# Altium project Hidro-Extra.PrjPCB
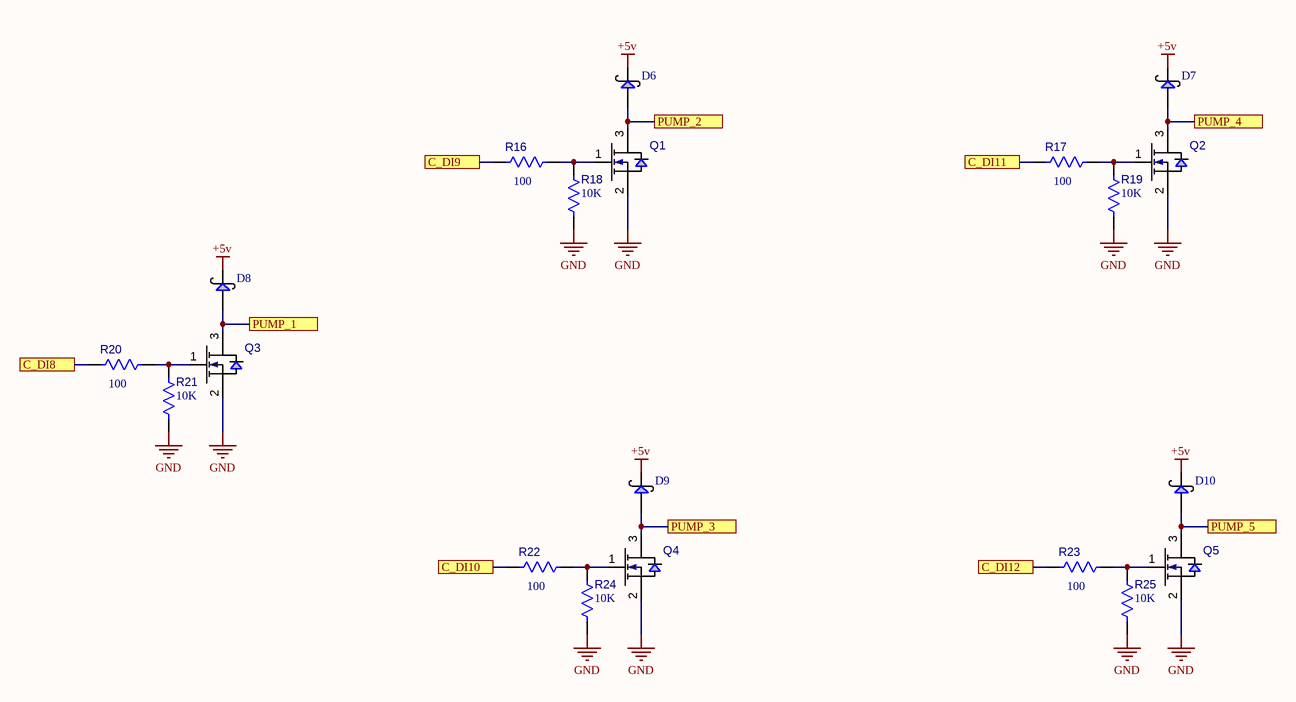
[diagram p0: pump.SchDoc]
3 sheets, 85 parts. Net scope: flat (ports and power ports of the same name join across sheets).
Board file: PCB_HidroExtra_v1.0.PcbDoc
Sheets:
  pump.SchDoc
  adc.SchDoc
  connectors.SchDoc

## Sheet pump.SchDoc
size A4

### Parts
D6  (no value)  [SOD123]
D7  (no value)  [SOD123]
D8  (no value)  [SOD123]
D9  (no value)  [SOD123]
D10  (no value)  [SOD123]
Q1  BSS138  [SOT23_N_123]  (value not drawn)
Q2  BSS138  [SOT23_N_123]  (value not drawn)
Q3  BSS138  [SOT23_N_123]  (value not drawn)
Q4  BSS138  [SOT23_N_123]  (value not drawn)
Q5  BSS138  [SOT23_N_123]  (value not drawn)
R16  100  [0805]
R17  100  [0805]
R18  10K  [0805]
R19  10K  [0805]
R20  100  [0805]
R21  10K  [0805]
R22  100  [0805]
R23  100  [0805]
R24  10K  [0805]
R25  10K  [0805]

### Ports
C_DI8, C_DI9, C_DI10, C_DI11, C_DI12, PUMP_1, PUMP_2, PUMP_3, PUMP_4, PUMP_5

### Nets
+5v: D6.2 D7.2 D8.2 D9.2 D10.2
GND: Q1.2 Q2.2 Q3.2 Q4.2 Q5.2 R18.1 R19.1 R21.1 R24.1 R25.1
NetD6_1: D6.1 Q1.3 ; port PUMP_2
NetD7_1: D7.1 Q2.3 ; port PUMP_4
NetD8_1: D8.1 Q3.3 ; port PUMP_1
NetD9_1: D9.1 Q4.3 ; port PUMP_3
NetD10_1: D10.1 Q5.3 ; port PUMP_5
NetJ6_1: R23.1 ; port C_DI12
NetJ6_2: R17.1 ; port C_DI11
NetJ6_3: R22.1 ; port C_DI10
NetJ6_4: R16.1 ; port C_DI9
NetJ6_5: R20.1 ; port C_DI8
NetQ1_1: Q1.1 R16.2 R18.2
NetQ2_1: Q2.1 R17.2 R19.2
NetQ3_1: Q3.1 R20.2 R21.2
NetQ4_1: Q4.1 R22.2 R24.2
NetQ5_1: Q5.1 R23.2 R25.2

### Library data of the parts
D6-D10 = MBRX160: SOD123
Q1-Q5 = BSS138: N-Channel MOSFET; Manufacturer: Fairchild; Voltage-Rated: 50V; Value: 6 Ohm Rdson; Package: SOT23
R16-R25 = Res: Resistor; Tolerance: 1%; Package: 0603
  R16 R17 R20 R22 R23: Value: 100
  R18 R19 R21 R24 R25: Value: 10K

## Sheet adc.SchDoc
size A4
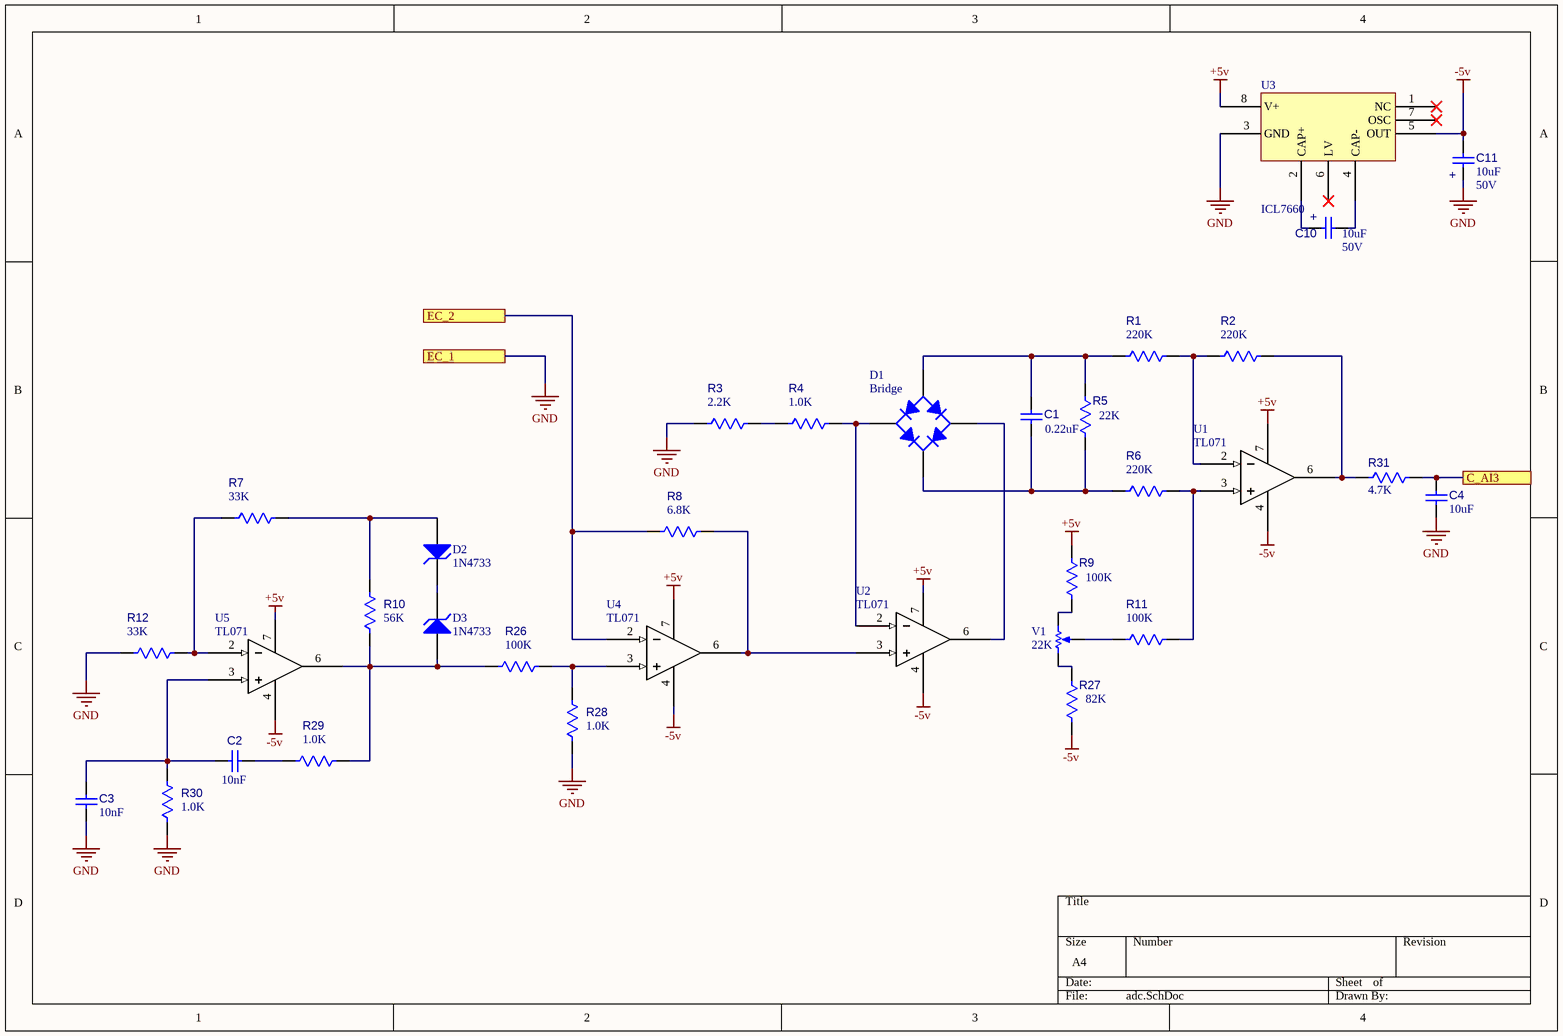
[diagram p1: adc.SchDoc]

### Parts
(Parts that share a designator on the sheet are numbered #1, #2 ... from top to bottom, then left to right.)
C1  0.22uF  [RAD-0.1]
C2  10nF  [0805]
C3  value 10nF  [0805]  (hidden comment: Cap)
C4  value 10uF  [CAPC1608x85N]  (hidden comment: Cap)
C10  Voltage-Rated: 50V  [CAPC3216x130N]  (hidden comment: 10uF)
C11  Voltage-Rated: 50V  [CAPC3216x130N]  (hidden comment: 10uF)
D1  Bridge  [BRIDGE_W]
D2  1N4733  [DO-35A]
D3  1N4733  [DO-35A]
R1  220K  [AXIAL-0.3]
R2  220K  [AXIAL-0.3]
R3  2.2K  [0805]
R4  1.0K  [0805]
R5  22K  [0805]
R6  220K  [AXIAL-0.3]
R7  33K  [0805]
R8  6.8K  [AXIAL-0.3]
R9  100K  [0805]
R10  56K  [0603]
R11  100K  [0805]
R12  33K  [0805]
R26#1  100K  [0805]
R27#1  82K  [0603]
R28#1  1.0K  [0805]
R29#1  1.0K  [0805]
R30  1.0K  [0805]
R31  4.7K  [0805]
U1  TL071  [DIP-8]
U2  TL071  [DIP-8]
U3  ICL7660  [SO8_N]
U4  TL071  [DIP-8]
U5  TL071  [DIP-8]
V1  22K  [TB-3x200]

### Ports
C_AI3, EC_1, EC_2

### Nets
+5v: R9.2 U1.7(+Vcc) U2.7(+Vcc) U3.8(V+) U4.7(+Vcc) U5.7(+Vcc)
-5v: C11.2 R27#1.1 U1.4(-Vcc) U2.4(-Vcc) U3.5(OUT) U4.4(-Vcc) U5.4(-Vcc)
GND: C3.2 C4.2 C11.1 R3.1 R12.1 R28#1.2 R30.2 U3.3(GND) ; port EC_1
NetC1_1: C1.1 D1.3(A) R1.1 R5.2
NetC1_2: C1.2 D1.1(K) R5.1 R6.1
NetC2_1: C2.1 C3.1 R30.1 U5.3(+)
NetC2_2: C2.2 R29#1.1
NetC4_1: C4.1 R31.1 ; port C_AI3
NetC10_1: C10.1 U3.2(CAP+)
NetC10_2: C10.2 U3.4(CAP-)
NetD1_2: D1.2(C) R4.2 U2.2(-)
NetD1_4: D1.4(C) U2.6(output)
NetD2_1: D2.1(A) R7.2 R10.1
NetD2_2: D2.2(K) D3.2(K)
NetD3_1: D3.1(A) R10.2 R26#1.1 R29#1.2 U5.6(output)
NetJ17_2: R8.1 U4.2(-) ; port EC_2
NetR1_2: R1.2 R2.1 U1.2(-)
NetR2_2: R2.2 R31.2 U1.6(output)
NetR3_2: R3.2 R4.1
NetR6_2: R6.2 R11.2 U1.3(+)
NetR7_1: R7.1 R12.2 U5.2(-)
NetR8_2: R8.2 U2.3(+) U4.6(output)
NetR9_1: R9.1 V1.3(BOT)
NetR11_1: R11.1 V1.2(TAP)
NetR26#1_2: R26#1.2 R28#1.1 U4.3(+)
NetR27#1_2: R27#1.2 V1.1(TOP)

Not connected (* = marked no-connect by the designer): U3 1(NC)* 6(LV)* 7(OSC)*

### Notes on the sheet
- (in symbol Cap Pol) +

### Library data of the parts
C1-C4 = Cap: Tolerance: ±10%; Voltage-Rated: 50V
  C1: Package: 0603; Value: 0.22uF
  C2: Package: 0805; Value: 10nF
  C3: Package: 0805
  C4: Package: 0603
C10 C11 = Cap Pol: Cap; Manufacturer: Panasonic; MfgPartNum: EEE-FC1H220P; Tolerance: ±10%; 3rdMfgr: Vishay / MAL214097103E3; Current: 90 mARMS; Package: 8mm dia.; Value: 10uF
D1 = Bridge: Full Wave Diode Bridge; Published: 8-Jun-2000; LatestRevisionDate: 29-May-2009; LatestRevisionNote: Sch pins A & K swapped.; DatasheetVersion: E2732B; PackageReference: D-38; Publisher: Altium Limited; PackageDescription: Bridge Rectifier; 4 Terminals; Body 9.4 x 9.4 mm (typ); Pitch 5.08 mm
D2 D3 = D Zener: Zener Diode 3.3v; Published: 8-Jun-2000; LatestRevisionDate: 17-Jul-2002; LatestRevisionNote: Re-released for DXP Platform.; PackageReference: DIODE-0.7; Publisher: Altium Limited; PackageDescription: Diode, Thru-Hole; 2 Leads; 0.7 in Pin Spacing
R1-R12 R26#1 R27#1 R28#1 R29#1 R30 R31 = Res: Resistor; Tolerance: 1%; Package: 0603
  R1 R2 R6: Value: 220K
  R3: Value: 2.2K
  R4 R28#1 R29#1 R30: Value: 1.0K
  R5: Value: 22K
  R7 R12: Value: 33K
  R8: Value: 6.8K
  R9 R11 R26#1: Value: 100K
  R10: Value: 56K
  R27#1: Value: 82K
  R31: Value: 4.7K
U1 U2 U4 U5 = TL071: Low-noise jfet-input operational amplifiers
U3 = ICL7660: CMOS Voltage Converters, from positive to negative for an input range of +1.5V to +10.0V
V1 = Preset: Potentiometer; Sim Note: Enter the Resistance value and the set point into parameter fields.; Set Position: 0.5; Published: 8-Jun-2000; LatestRevisionDate: 17-Jul-2002; LatestRevisionNote: Re-released for DXP Platform.; PackageReference: VR5; Publisher: Altium Limited; PackageDescription: Variable Resistor, Thru-Hole; 3 Leads; Value: 22K

## Sheet connectors.SchDoc
size A4
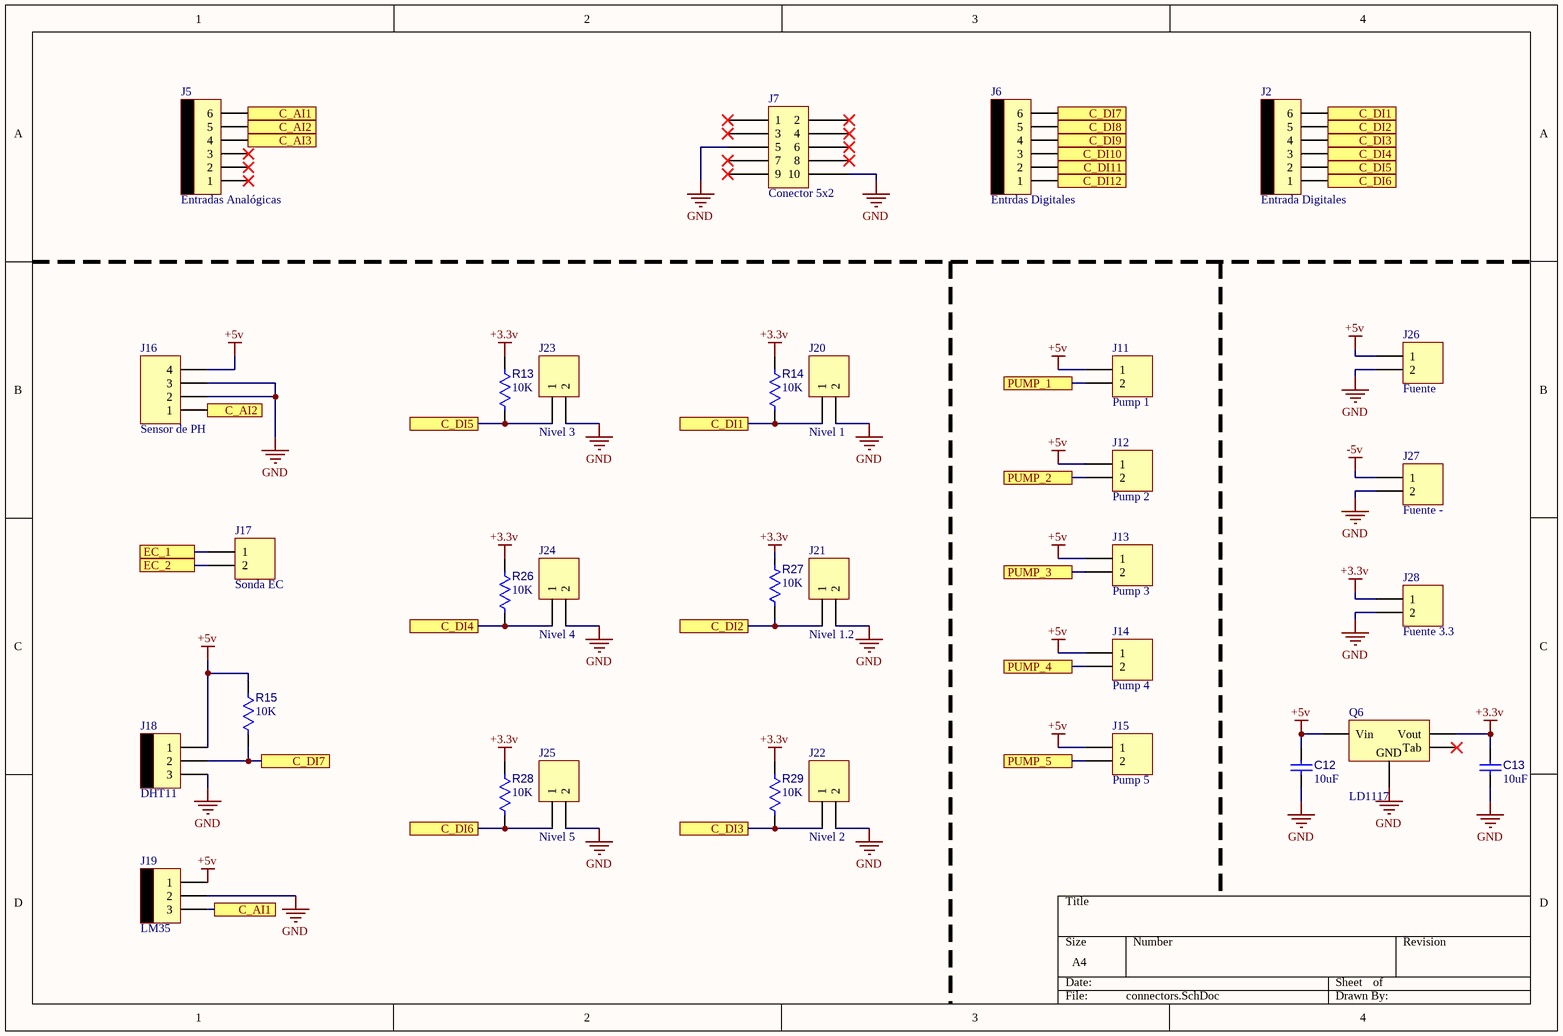
[diagram p2: connectors.SchDoc]

### Parts
(Parts that share a designator on the sheet are numbered #1, #2 ... from top to bottom, then left to right.)
C12  10uF  [CAPC3216x130N]
C13  10uF  [CAPC3216x130N]
J2  Entrada Digitales  [MOLEX6]
J5  Entradas Analógicas  [MOLEX6]
J6  Entrdas Digitales  [MOLEX6]
J7  Conector 5x2  [CONN_5x2_BOX]
J11  Pump 1  [MOLEX2]
J12  Pump 2  [MOLEX2]
J13  Pump 3  [MOLEX2]
J14  Pump 4  [MOLEX2]
J15  Pump 5  [MOLEX2]
J16  Sensor de PH  [HDR1X4]
J17  Sonda EC  [HDR1X2H]
J18  DHT11  [MOLEX3]
J19  LM35  [MOLEX3]
J20  Nivel 1  [MOLEX2]
J21  Nivel 1.2  [MOLEX2]
J22  Nivel 2  [MOLEX2]
J23  Nivel 3  [MOLEX2]
J24  Nivel 4  [MOLEX2]
J25  Nivel 5  [MOLEX2]
J26  Fuente  [CON_2_156]
J27  Fuente -  [HDR1X2]
J28  Fuente 3.3  [HDR1X2]
Q6  LD1117  [SOT223_N]
R13  10K  [0805]
R14  10K  [0805]
R15  10K  [0805]
R26#2  10K  [0805]
R27#2  10K  [0805]
R28#2  10K  [0805]
R29#2  10K  [0805]

### Ports
C_AI1, C_AI2, C_AI3, C_DI1, C_DI2, C_DI3, C_DI4, C_DI5, C_DI6, C_DI7, C_DI8, C_DI9, C_DI10, C_DI11, C_DI12, EC_1, EC_2, PUMP_1, PUMP_2, PUMP_3, PUMP_4, PUMP_5

### Nets
+3.3v: C13.2 J28.1 Q6.2(Vout) R13.2 R14.2 R26#2.2 R27#2.2 R28#2.2 R29#2.2
+5v: C12.1 J11.1 J12.1 J13.1 J14.1 J15.1 J16.4 J18.1 J19.1 J26.1 Q6.3(Vin) R15.2
-5v: J27.1
GND: C12.2 C13.1 J7.5 J7.10 J16.2 J16.3 J17.1 J18.3 J19.2 J20.2 J21.2 J22.2 J23.2 J24.2 J25.2 J26.2 J27.2 J28.2 Q6.1(GND) ; port EC_1
NetC4_1: J5.4 ; port C_AI3
NetD6_1: J12.2 ; port PUMP_2
NetD7_1: J14.2 ; port PUMP_4
NetD8_1: J11.2 ; port PUMP_1
NetD9_1: J13.2 ; port PUMP_3
NetD10_1: J15.2 ; port PUMP_5
NetJ2_1: J2.1 J25.1 R28#2.1 ; port C_DI6
NetJ2_2: J2.2 J23.1 R13.1 ; port C_DI5
NetJ2_3: J2.3 J24.1 R26#2.1 ; port C_DI4
NetJ2_4: J2.4 J22.1 R29#2.1 ; port C_DI3
NetJ2_5: J2.5 J21.1 R27#2.1 ; port C_DI2
NetJ2_6: J2.6 J20.1 R14.1 ; port C_DI1
NetJ5_5: J5.5 J16.1 ; port C_AI2
NetJ5_6: J5.6 J19.3 ; port C_AI1
NetJ6_1: J6.1 ; port C_DI12
NetJ6_2: J6.2 ; port C_DI11
NetJ6_3: J6.3 ; port C_DI10
NetJ6_4: J6.4 ; port C_DI9
NetJ6_5: J6.5 ; port C_DI8
NetJ6_6: J6.6 J18.2 R15.1 ; port C_DI7
NetJ17_2: J17.2 ; port EC_2

Not connected (* = marked no-connect by the designer): J5 1* 2* 3*; J7 1* 2* 3* 4* 6* 7* 8* 9*; Q6 4(Tab)*

### Library data of the parts
C12 C13 = Cap: Tolerance: ±10%; Voltage-Rated: 6.3V; Package: 0603; Value: 10uF
J2 J5 J6 = MOLEX6
J11-J15 J20-J26 = Header 2: Header, 2-Pin; LatestRevisionDate: 17-Jul-2002; LatestRevisionNote: Re-released for DXP Platform.; Publisher: Altium Limited
J16 = Header 4: LatestRevisionDate: 17-Jul-2002; LatestRevisionNote: Re-released for DXP Platform.; Publisher: Altium Limited
J17 = Header 2H: Header, 2-Pin, Right Angle; LatestRevisionDate: 17-Jul-2002; LatestRevisionNote: Re-released for DXP Platform.; Publisher: Altium Limited
J18 J19 = MOLEX3
J27 J28 = Header 2: LatestRevisionDate: 17-Jul-2002; LatestRevisionNote: Re-released for DXP Platform.; Publisher: Altium Limited
Q6 = LD1117: Voltage Reg., Low Drop; PackageReference: SOT-223; PackageDescription: 3-Pin Transistor Outline Package 2.54 mm Pitch, 15.1 mm Lead Span
R13-R15 R26#2 R27#2 R28#2 R29#2 = Res: Resistor; Tolerance: 1%; Package: 0603; Value: 10K

## Nets that join several sheets
+5v: pump (5 pins), adc (6 pins), connectors (12 pins)
-5v: adc (7 pins), connectors (J27.1)
GND: pump (10 pins), adc (8 pins), connectors (19 pins)
NetC4_1: adc (C4.1 R31.1), connectors (J5.4)
NetD6_1: pump (D6.1 Q1.3), connectors (J12.2)
NetD7_1: pump (D7.1 Q2.3), connectors (J14.2)
NetD8_1: pump (D8.1 Q3.3), connectors (J11.2)
NetD9_1: pump (D9.1 Q4.3), connectors (J13.2)
NetD10_1: pump (D10.1 Q5.3), connectors (J15.2)
NetJ6_1: pump (R23.1), connectors (J6.1)
NetJ6_2: pump (R17.1), connectors (J6.2)
NetJ6_3: pump (R22.1), connectors (J6.3)
NetJ6_4: pump (R16.1), connectors (J6.4)
NetJ6_5: pump (R20.1), connectors (J6.5)
NetJ17_2: adc (R8.1 U4.2), connectors (J17.2)